# EAGLE schematic ig-normal-ver12_rev (EAGLE 9.6.2)
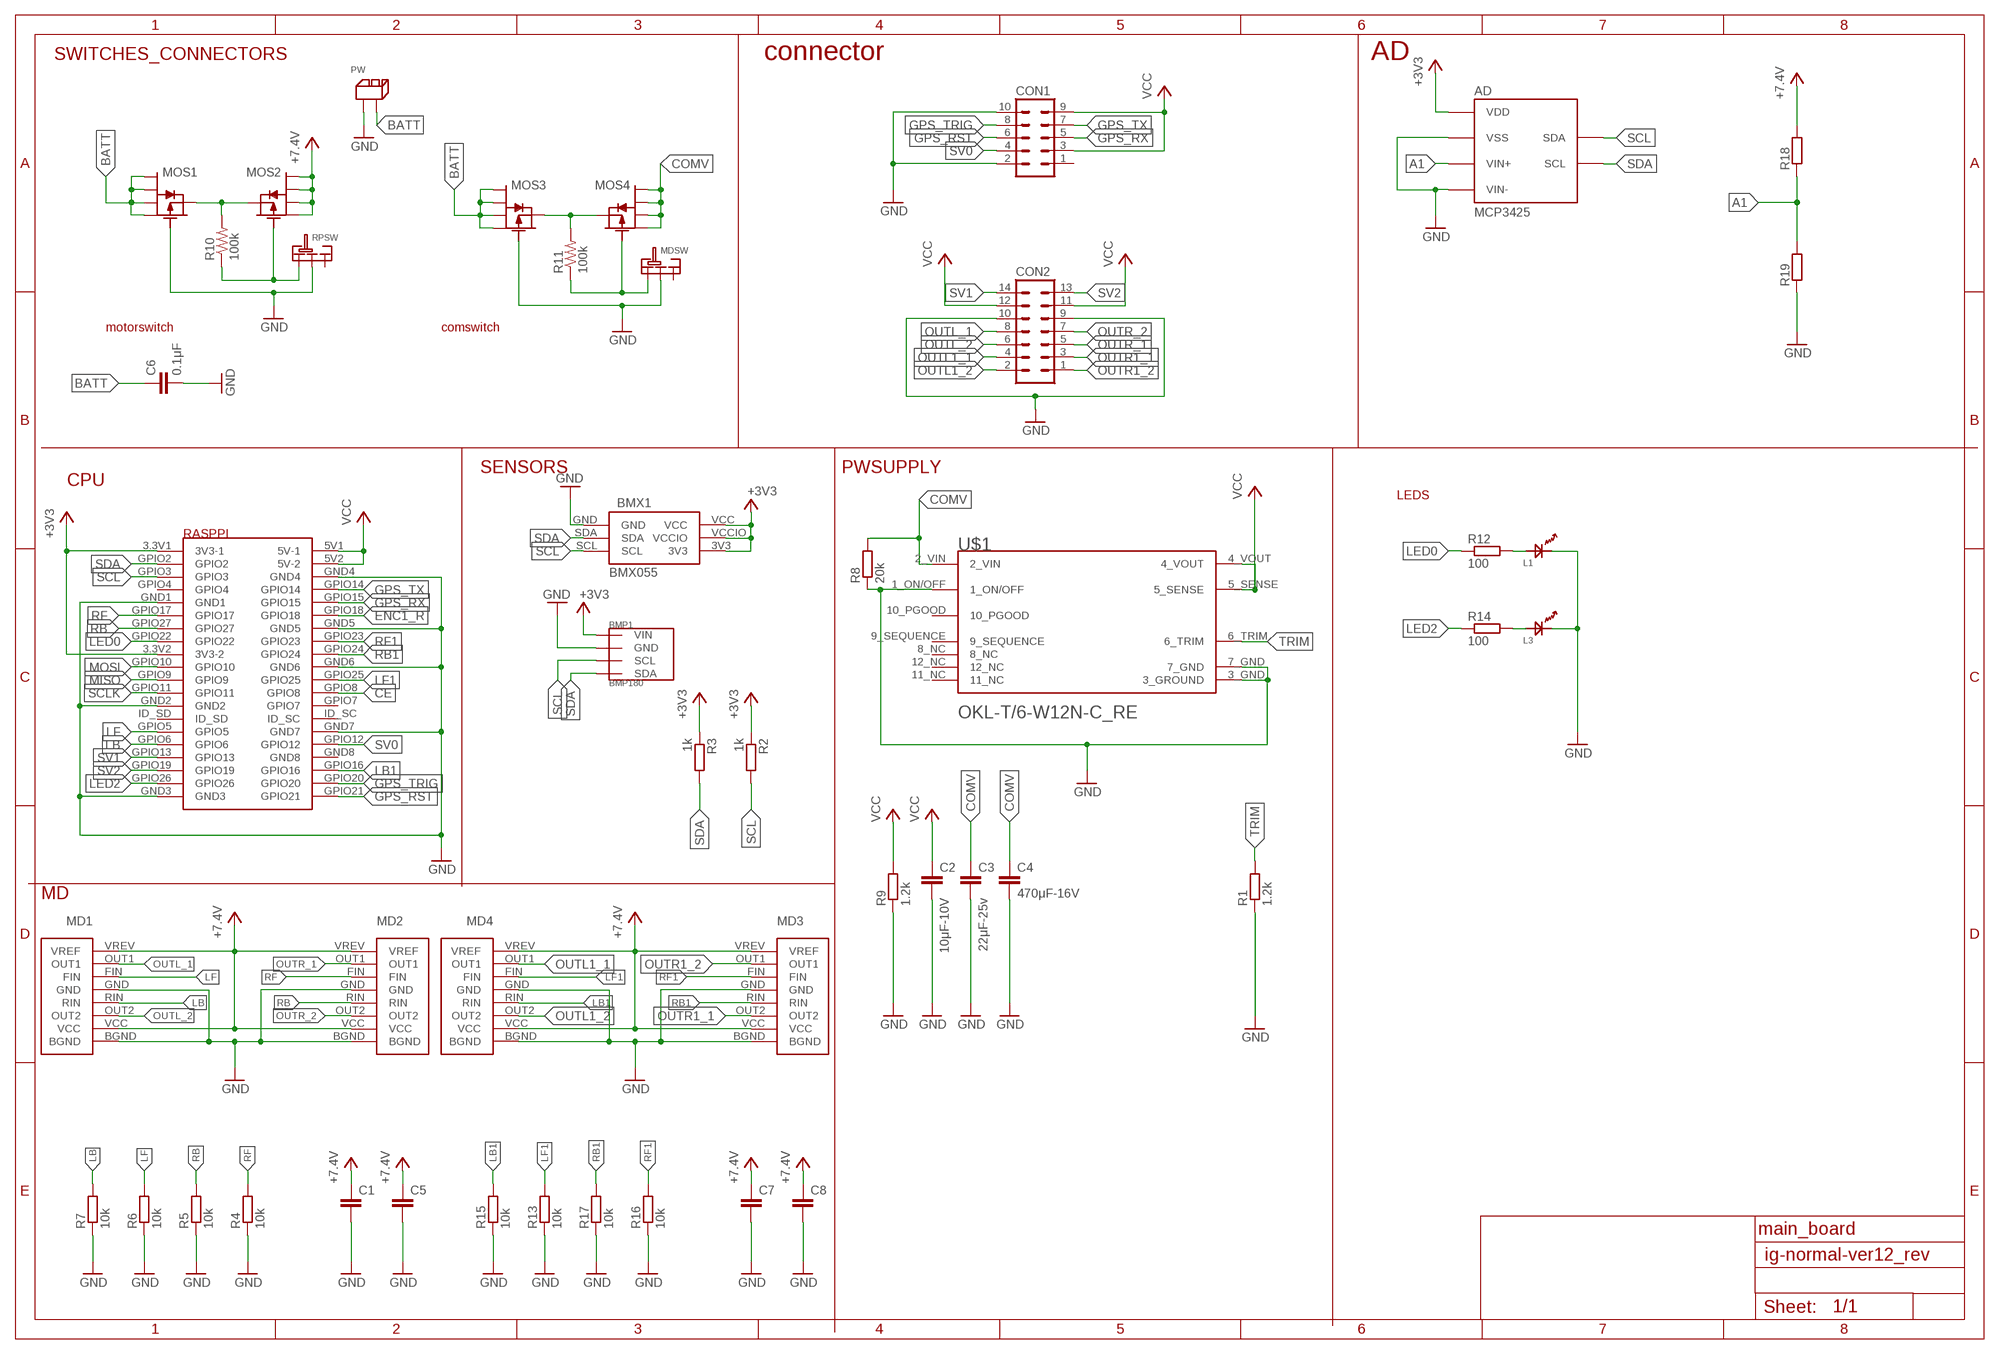
[diagram p0: schematic, sheet 1]

## Parts
AD  MCP3425  [SOT23-6]
BMP1  BMP180  [GY-68]
BMX1  BMX055  [BMX055]
C1  C-EUC0603  [C0603]
C2  10μF-10V  C-EUC0603  [C0603]
C3  22μF-25v  C-EUC0805  [C0805]
C4  470μF-16V  C-EUC0603  [C0603]
C5  C-EUC0603  [C0603]
C6  0.1μF  C-EUC0603  [C0603]
C7  C-EUC0603  [C0603]
C8  C-EUC0603  [C0603]
CON1  ML10L  [ML10L]
CON2  ML14L  [ML14L]
L1  OSXX1608C1A  [OSXX1608C1A]
L3  OSXX1608C1A  [OSXX1608C1A]
MD1  BD6222HFP-TR  [BD6222HFP-TR]
MD2  BD6222HFP-TR  [BD6222HFP-TR]
MD3  BD6222HFP-TR  [BD6222HFP-TR]
MD4  BD6222HFP-TR  [BD6222HFP-TR]
MDSW  SRIDE_SWITCH  [SRIDE_SWITCH]
MOS1  PCH_SSM6J808R  [SSM6J808R]
MOS2  PCH_SSM6J808R  [SSM6J808R]
MOS3  PCH_SSM6J808R  [SSM6J808R]
MOS4  PCH_SSM6J808R  [SSM6J808R]
PW  2PIN  [2PIN]
R1  1.2k  R-EU_R0805  [R0805]
R2  1k  R-EU_R0603  [R0603]
R3  1k  R-EU_R0603  [R0603]
R4  10k  R-EU_R0603  [R0603]
R5  10k  R-EU_R0603  [R0603]
R6  10k  R-EU_R0603  [R0603]
R7  10k  R-EU_R0603  [R0603]
R8  20k  R-EU_R0603  [R0603]
R9  1.2k  R-EU_R0805  [R0805]
R10  100k  R-US_R0603  [R0603]
R11  100k  R-US_R0603  [R0603]
R12  100  R-EU_R0603  [R0603]
R13  10k  R-EU_R0603  [R0603]
R14  100  R-EU_R0603  [R0603]
R15  10k  R-EU_R0603  [R0603]
R16  10k  R-EU_R0603  [R0603]
R17  10k  R-EU_R0603  [R0603]
R18  R-EU_R0603  [R0603]
R19  R-EU_R0603  [R0603]
RASPPI  RASPBERYPIZEROW  [RASPBERYPIZEROW]
RPSW  SRIDE_SWITCH  [SRIDE_SWITCH]
U$1  OKL-T/6-W12N-C_RE  [MURATA_IKL-T-6-W12N-C_0_RECOMENDED]

## Nets
+3V3: AD.5(VDD) BMP1.P1(VIN) BMX1.3V3 BMX1.VCC BMX1.VCCIO R2.1 R3.1 RASPPI.3.3V1(3V3-1) RASPPI.3.3V2(3V3-2)
+5V: C1.1 C5.1 C7.1 C8.1 MD1.VCC MD1.VREV(VREF) MD2.VCC MD2.VREV(VREF) MD3.VCC MD3.VREV(VREF) MD4.VCC MD4.VREV(VREF) MOS2.1 MOS2.2 MOS2.5 MOS2.6 R18.2 ; supply symbol labelled +7.4V
A1: AD.1(VIN+) R18.1 R19.2
BATT: C6.1 MOS1.1 MOS1.2 MOS1.5 MOS1.6 MOS3.1 MOS3.2 MOS3.5 MOS3.6 PW.P$2
CE: RASPPI.GPIO8
COMV: C3.1 C4.1 MOS4.1 MOS4.2 MOS4.5 MOS4.6 R8.2 U$1.2_VIN
ENC1_R: RASPPI.GPIO18
GND: AD.2(VSS) AD.6(VIN-) BMP1.P2(GND) BMX1.GND C1.2 C2.2 C3.2 C4.2 C5.2 C6.2 C7.2 C8.2 CON1.2 CON1.10 CON2.9 CON2.10 L1.CT L3.CT MD1.BGND MD1.GND MD2.BGND MD2.GND MD3.BGND MD3.GND MD4.BGND MD4.GND MDSW.LR MOS1.3 MOS3.3 PW.P$1 R1.1 R4.1 R5.1 R6.1 R7.1 R8.1 R9.1 R13.1 R15.1 R16.1 R17.1 R19.1 RASPPI.GND1 RASPPI.GND2 RASPPI.GND3 RASPPI.GND4 RASPPI.GND5 RASPPI.GND6 RASPPI.GND7 RPSW.LR U$1.1_ON/OFF U$1.3_GND(3_GROUND) U$1.7_GND
GPS_RST: CON1.6 RASPPI.GPIO21
GPS_RX: CON1.5 RASPPI.GPIO15
GPS_TRIG: CON1.8 RASPPI.GPIO20
GPS_TX: CON1.7 RASPPI.GPIO14
LB: MD1.RIN R7.2 RASPPI.GPIO6
LB1: MD4.RIN R15.2 RASPPI.GPIO16
LED0: R12.1 RASPPI.GPIO22
LED2: R14.1 RASPPI.GPIO26
LF: MD1.FIN R6.2 RASPPI.GPIO5
LF1: MD4.FIN R13.2 RASPPI.GPIO25
MISO: RASPPI.GPIO9
MOSI: RASPPI.GPIO10
N$1: MOS3.4 MOS4.4 R11.2
N$2: MDSW.L MOS4.3 R11.1
N$3: L1.AN R12.2
N$5: L3.AN R14.2
N$6: MOS1.4 MOS2.4 R10.2
N$7: MOS2.3 R10.1 RPSW.L
OUTL1_1: CON2.4 MD4.OUT1
OUTL1_2: CON2.2 MD4.OUT2
OUTL_1: CON2.8 MD1.OUT1
OUTL_2: CON2.6 MD1.OUT2
OUTR1_1: CON2.3 MD3.OUT2
OUTR1_2: CON2.1 MD3.OUT1
OUTR_1: CON2.5 MD2.OUT1
OUTR_2: CON2.7 MD2.OUT2
RB: MD2.RIN R5.2 RASPPI.GPIO27
RB1: MD3.RIN R17.2 RASPPI.GPIO24
RF: MD2.FIN R4.2 RASPPI.GPIO17
RF1: MD3.FIN R16.2 RASPPI.GPIO23
SCL: AD.4(SDA) BMP1.P3(SCL) BMX1.SCL R2.2 RASPPI.GPIO3
SCLK: RASPPI.GPIO11
SDA: AD.3(SCL) BMP1.P4(SDA) BMX1.SDA R3.2 RASPPI.GPIO2
SV0: CON1.4 RASPPI.GPIO12
SV1: CON2.14 RASPPI.GPIO13
SV2: CON2.13 RASPPI.GPIO19
TRIM: R1.2 U$1.6_TRIM
VCC: C2.1 CON1.3 CON1.9 CON2.11 CON2.12 R9.2 RASPPI.5V1(5V-1) RASPPI.5V2(5V-2) U$1.4_VOUT U$1.5_SENSE
Unconnected: CON1.1 MDSW.R RASPPI.GND8 RASPPI.GPIO4 RASPPI.GPIO7 RASPPI.ID_SC RASPPI.ID_SD RPSW.R U$1.8_NC U$1.9_SEQUENCE U$1.10_PGOOD U$1.11_NC U$1.12_NC

## Notes on the sheet
- SWITCHES_CONNECTORS | connector | AD
- motorswitch | comswitch
- SENSORS | PWSUPPLY
- CPU
- LEDS
- MD
- main_board

## Library data of the parts
AD = bt:MCP3425: Microchip MCP3425 ADC The MCP3425 is a single channel low-noise, high accuracy ?? A/D converter with differential inputs and up to 16 bits of resolution in a small SOT-23-6 package. The on-board precision 2.048V reference voltage enables an input range of ±2.048V differentially (? voltage = 4.096V). The device uses a two-wire I2C compatible serial interface and operates from a single 2.7V to 5.5V power supply. The MCP3425 device performs conversion at rates of 15, 60, or 240 samples per second (SPS) depending on the user controllable configuration bit settings using the two-wire I2C serial interface Reference: http://ww1.microchip.com/downloads/en/DeviceDoc/22072a.pdf
BMP1 = BMP180:BMP180
BMX1 = BMX055:BMX055
C1-C8 = rcl:C-EU: CAPACITOR, European symbol; SPICEPREFIX: C
CON1 = con-ml:ML10L
CON2 = con-ml:ML14L
L1 L3 = Chip LED:OSXX1608C1A
MD1-MD4 = BD6222HFP-TR:BD6222HFP-TR
MDSW RPSW = Sride Switch:SRIDE_SWITCH
MOS1-MOS4 = Chip MOSFET:PCH_SSM6J808R
PW = XR Connector:2PIN
R1-R9 R12-R19 = rcl:R-EU_: RESISTOR, European symbol; SPICEPREFIX: R
R10 R11 = rcl:R-US_: RESISTOR, American symbol; SPICEPREFIX: R
RASPPI = RaspberyPiZeroW:RASPBERYPIZEROW
U$1 = OKL-T_6-W12N-C:OKL-T/6-W12N-C_RE